# EAGLE schematic power supply (EAGLE 9.6.2)
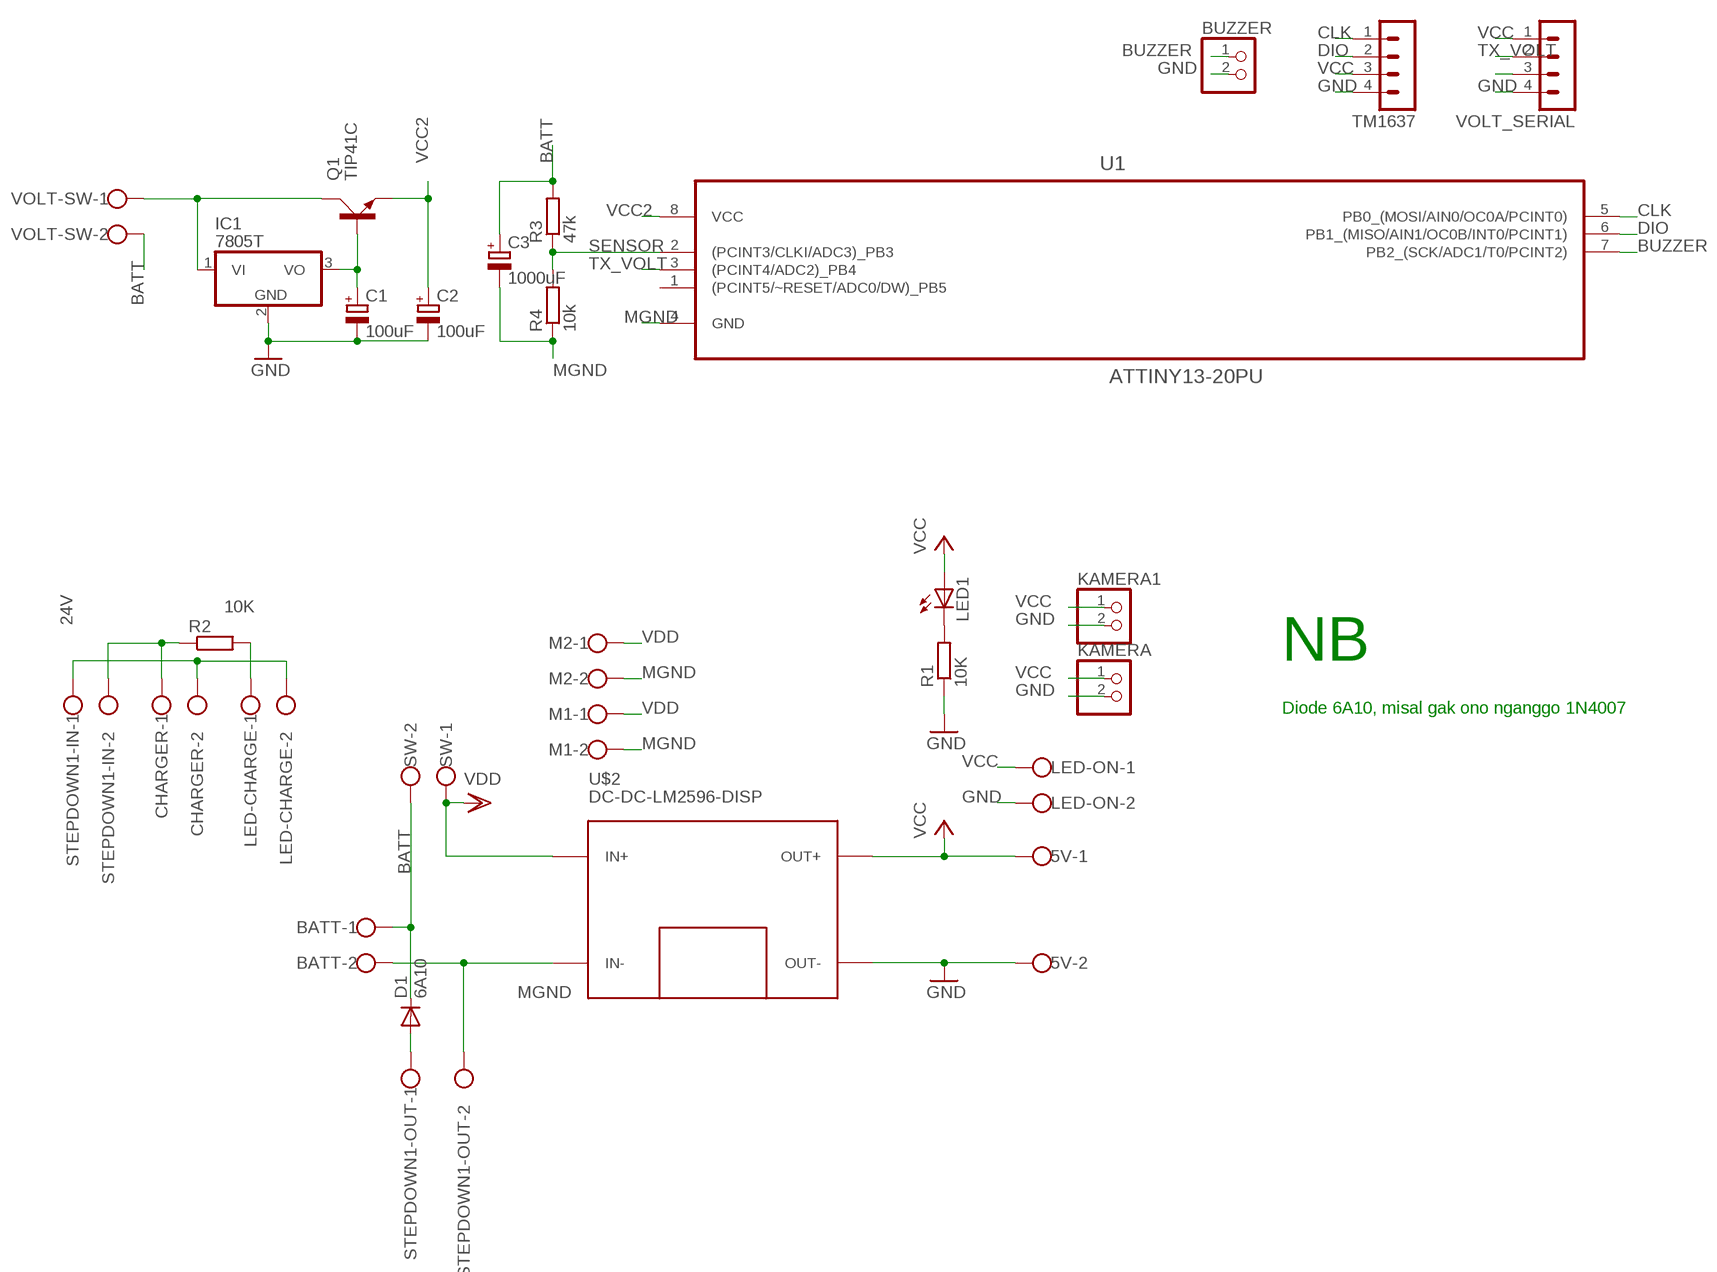
[diagram p0: schematic, sheet 1]

## Parts
5V  W237-102  [W237-102]
BATT  W237-102  [W237-102]
BUZZER  PINHD-1X2  [1X02]
C1  100uF  CPOL-EUE2-4  [E2-4]
C2  100uF  CPOL-EUE2-4  [E2-4]
C3  1000uF  CPOL-EUETR4  [ETR4]
CHARGER  W237-102  [W237-102]
D1  6A10  1N4004  [DO41-10]
IC1  7805T  [TO220H]
KAMERA  PINHD-1X2  [1X02]
KAMERA1  PINHD-1X2  [1X02]
LED1  LED5MM  [LED5MM]
LED-CHARGE  W237-102  [W237-102]
LED-ON  W237-102  [W237-102]
M1  W237-102  [W237-102]
M2  W237-102  [W237-102]
Q1  TIP41C  [TO220AV]
R1  10K  R-EU_0207/10  [0207/10]
R2  10K  R-EU_0617/22  [0617/22]
R3  47k  R-EU_0411/12  [0411/12]
R4  10k  R-EU_0411/12  [0411/12]
STEPDOWN1-IN  W237-102  [W237-102]
STEPDOWN1-OUT  W237-102  [W237-102]
SW  W237-102  [W237-102]
TM1637  MA04-1  [MA04-1]
U1  ATTINY13-20PU  [DIP254P762X533-8]
U$2  DC-DC-LM2596-DISP  [DC-DC-LM2596-DISP]
VOLT-SW  W237-102  [W237-102]
VOLT_SERIAL  MA04-1  [MA04-1]

## Nets
24V: CHARGER.1 R2.1 STEPDOWN1-IN.2
BATT: BATT.1 C3.+ D1.C R3.2 SW.2 VOLT-SW.2
BUZZER: BUZZER.1 U1.7(PB2_(SCK/ADC1/T0/PCINT2))
CLK: TM1637.1 U1.5(PB0_(MOSI/AIN0/OC0A/PCINT0))
DIO: TM1637.2 U1.6(PB1_(MISO/AIN1/OC0B/INT0/PCINT1))
GND: 5V.2 BUZZER.2 C1.- C2.- IC1.2(GND) KAMERA1.2 KAMERA.2 LED-ON.2 R1.1 TM1637.4 U$2.OUT- VOLT_SERIAL.4
MGND: BATT.2 C3.- M1.2 M2.2 R4.1 STEPDOWN1-OUT.2 U1.4(GND) U$2.IN-
N$1: C1.+ IC1.3(VO) Q1.B
N$2: IC1.1(VI) Q1.C VOLT-SW.1
N$3: D1.A STEPDOWN1-OUT.1
N$5: LED1.K(C) R1.2
N$6: CHARGER.2 LED-CHARGE.2 STEPDOWN1-IN.1
N$7: LED-CHARGE.1 R2.2
N$10: VOLT_SERIAL.3
SENSOR: R3.1 R4.2 U1.2((PCINT3/CLKI/ADC3)_PB3)
TX_VOLT: U1.3((PCINT4/ADC2)_PB4) VOLT_SERIAL.2
VCC: 5V.1 KAMERA1.1 KAMERA.1 LED1.A LED-ON.1 TM1637.3 U$2.OUT+ VOLT_SERIAL.1
VCC2: C2.+ Q1.E U1.8(VCC)
VDD: M1.1 M2.1 SW.1 U$2.IN+
Unconnected: U1.1((PCINT5/~RESET/ADC0/DW)_PB5)

## Notes on the sheet
- NB
- Diode 6A10, misal gak ono nganggo 1N4007

## Library data of the parts
5V BATT CHARGER LED-CHARGE LED-ON M1 M2 STEPDOWN1-IN STEPDOWN1-OUT SW VOLT-SW = con-wago-500:W237-102: WAGO SCREW CLAMP; MPN: 237-102; OC_FARNELL: unknown; OC_NEWARK: 70K9898
BUZZER KAMERA KAMERA1 = pinhead:PINHD-1X2: PIN HEADER
C1 C2 = rcl:CPOL-EU: POLARIZED CAPACITOR, European symbol; SPICEPREFIX: C
C3 = resistor:CPOL-EU: POLARIZED CAPACITOR, European symbol
D1 = adafruit:1N4004: DIODE General purpose 1N400x type rectifier (With bigger pads) http://www.ladyada.net/library/pcb/eaglelibrary.html
IC1 = adafruit:78*: Positive VOLTAGE REGULATOR Added bigger pads to the TO-92 package
LED1 = adafruit:LED: LED OSRAM: - CHIPLED LG R971, LG N971, LY N971, LG Q971, LY Q971, LO R971, LY R971 LH N974, LH R974 LS Q976, LO Q976, LY Q976 LO Q996 - Hyper CHIPLED LW Q18S LB Q993, LB Q99A, LB R99A - SideLED LS A670, LO A670, LY A670, LG A670, LP A670 LB A673, LV A673, LT A673, LW A673 LH A674 LY A675 LS A676, LA A676, LO A676, LY A676, LW A676 LS A679, LY A679, LG A679 - Hyper Micro SIDELED® LS Y876, LA Y876, LO Y876, LY Y876 LT Y87S - SmartLED LW L88C, LW L88S LB L89C, LB L89S, LG L890 LS L89K, LO L89K, LY L89K LS L896, LA L896, LO L896, LY L896 - TOPLED LS T670, LO T670, LY T670, LG T670, LP T670 LSG T670, LSP T670, LSY T670, LOP T670, LYG T670 LG T671, LOG T671, LSG T671 LB T673, LV T673, LT T673, LW T673 LH T674 LS T676, LA T676, LO T676, LY T676, LB T676, LH T676, LSB T676, LW T676 LB T67C, LV T67C, LT T67C, LS T67K, LO T67K, LY T67K, LW E67C LS E67B, LA E67B, LO E67B, LY E67B, LB E67C, LV E67C, LT E67C LW T67C LS T679, LY T679, LG T679 LS T770, LO T770, LY T770, LG T770, LP T770 LB T773, LV T773, LT T773, LW T773 LH T774 LS E675, LA E675, LY E675, LS T675 LS T776, LA T776, LO T776, LY T776, LB T776 LHGB T686 LT T68C, LB T68C - Hyper Mini TOPLED® LB M676 - Mini TOPLED Santana® LG M470 LS M47K, LO M47K, LY M47K Source: http://www.osram.convergy.de/
Q1 = transistor-power:TIP41C: NPN TRANSISTOR
R1-R4 = rcl:R-EU_: RESISTOR, European symbol; SPICEPREFIX: R
TM1637 VOLT_SERIAL = con-lstb:MA04-1: PIN HEADER; OC_FARNELL: unknown; OC_NEWARK: unknown
U1 = ATTINY13-20PU:ATTINY13-20PU: 8-bit MCU; ARROW_ELECTRONICS-PURCHASE-URL: https://snapeda.com/shop?store=Arrow+Electronics&id=700279; AVAILABILITY: Unavailable; DESCRIPTION: AVR AVR® ATtiny Microcontroller IC 8-Bit 20MHz 1KB (512 x 16) FLASH 8-PDIP; DIGIKEY-PURCHASE-URL: https://snapeda.com/shop?store=DigiKey&id=700279; MF: Microchip; MOUSER-PURCHASE-URL: https://snapeda.com/shop?store=Mouser&id=700279; MP: ATTINY13-20PU; PACKAGE: DIP-8 Microchip; PRICE: None
U$2 = lm2596 display:DC-DC-LM2596-DISP: DC/DC Step-Down Regulator with Voltage Display based on LM2596-ADJ chip More details available here: http://www.instructables.com/id/The-Introduction-of-LM2596-Step-Down-Power-Module-/ LM2596 datasheet available here: http://www.ti.com/lit/ds/symlink/lm2596.pdf Click here to find device on ebay.com <http://www.ebay.com/sch/lm2596+led+voltmeter+40>